# EAGLE design power supply (EAGLE 9.6.2)
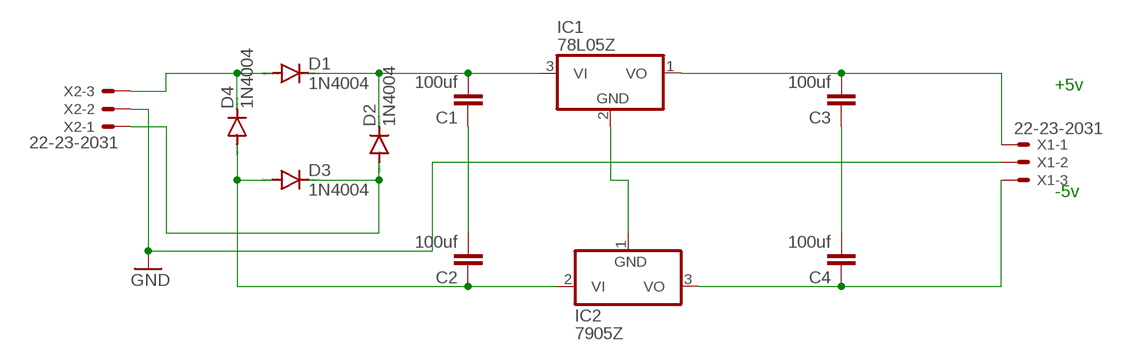
[diagram p0: schematic, sheet 1]

## Parts
C1  100uf  C2,5-3  [C2.5-3]
C2  100uf  C2,5-3  [C2.5-3]
C3  100uf  C2,5-3  [C2.5-3]
C4  100uf  C2,5-3  [C2.5-3]
D1  1N4004  [DO41-10]
D2  1N4004  [DO41-10]
D3  1N4004  [DO41-10]
D4  1N4004  [DO41-10]
IC1  78L05Z  [TO92]
IC2  7905Z  79L05Z  [TO92]
X1  22-23-2031  [22-23-2031]
X2  22-23-2031  [22-23-2031]

## Nets
GND: X1.2 X2.2
N$1: D1.A D4.C X2.3
N$2: C2.1 D3.A D4.A IC2.2(VI)
N$3: D2.A D3.C X2.1
N$4: C1.2 D1.C D2.C IC1.3(VI)
N$5: IC1.2(GND) IC2.1(GND)
N$6: C1.1 C2.2
N$7: C4.1 IC2.3(VO) X1.3
N$8: C3.2 IC1.1(VO) X1.1
N$9: C3.1 C4.2

## Notes on the sheet
- +5v
- -5v

## Library data of the parts
C1-C4 = capacitor-wima:C: CAPACITOR naming: grid - package width
D1-D4 = diode:1N4004: DIODE general purpose rectifier, 1 A
IC1 = linear:78*: Positive VOLTAGE REGULATOR Source: http://cache.national.com/ds/LM/LM78L05.pdf http://www.fairchildsemi.com/ds/LM/LM7805.pdf
IC2 = linear:79*: Negative VOLTAGE REGULATOR
X1 X2 = con-molex:22-23-2031: .100" (2.54mm) Center Header - 3 Pin; MF: MOLEX; MPN: 22-23-2031; OC_FARNELL: 1462950; OC_NEWARK: 30C0862

## Board
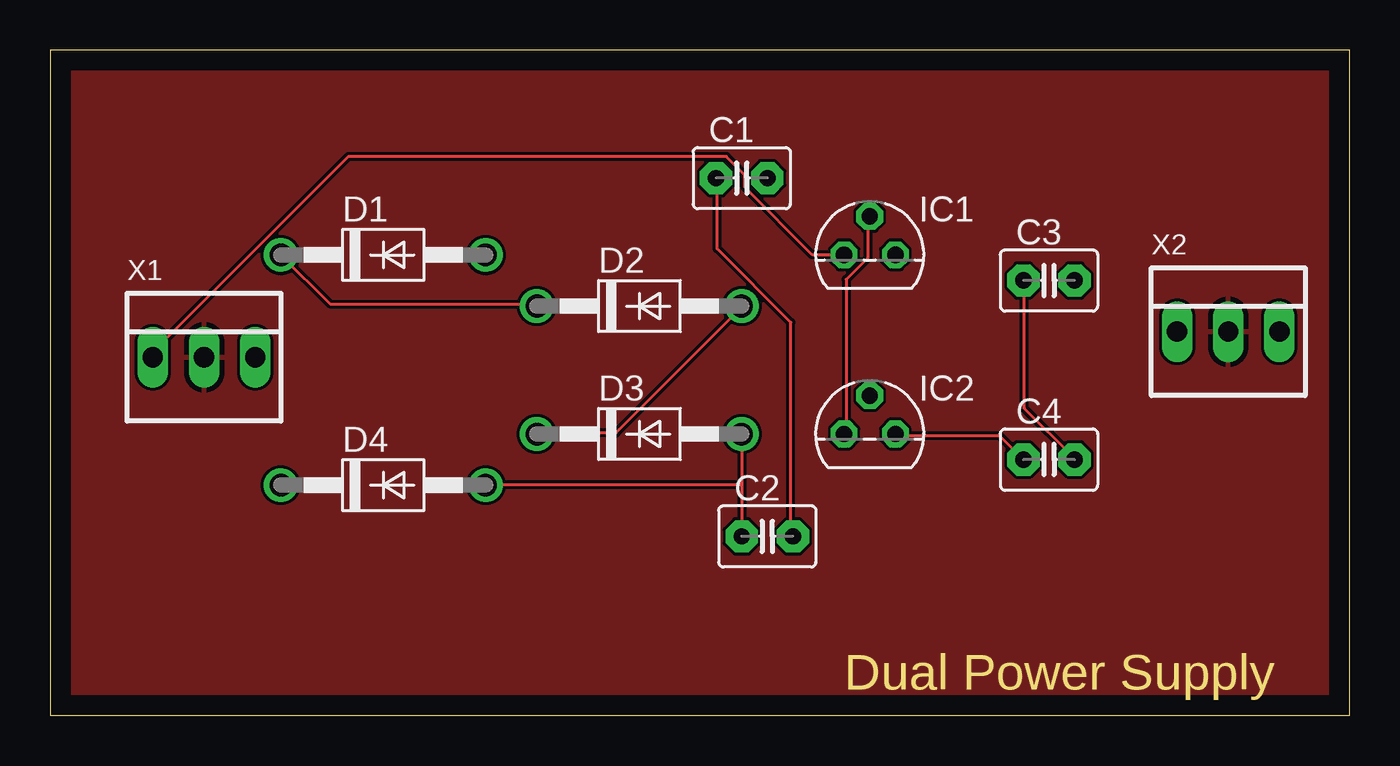
[diagram p1: board, top side]
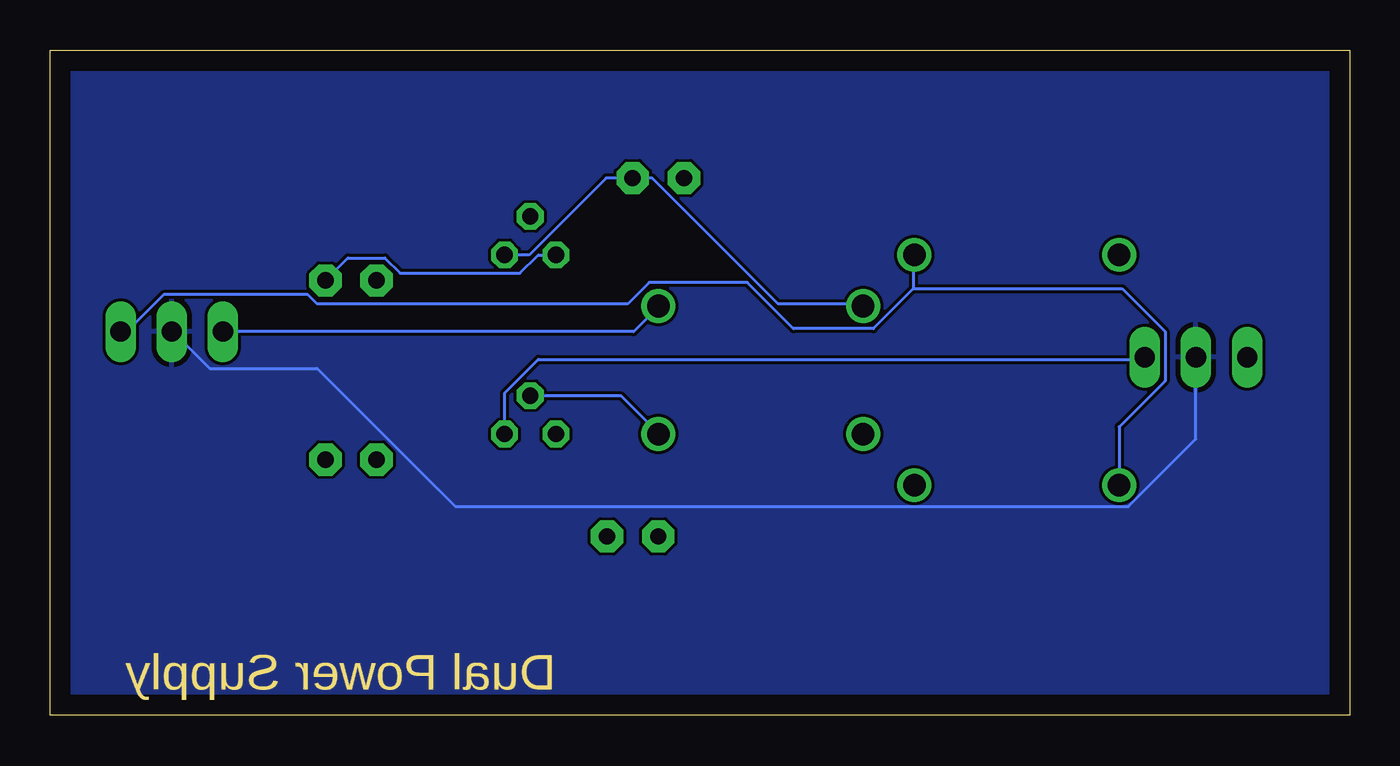
[diagram p2: board, bottom side, seen from below]

Size 64.44 x 33.01 mm. Coordinates in mm from the lower left corner, seen from the top.
Outline: 0,0 64.44,0 64.44,33.01 0,33.01 0,0
Copper layers (1*16): Top 0.035mm / dielectric 1.5mm / Bottom 0.035mm
Design rules "default": minimum track width 6mil, minimum drill 0.35mm, track to track 6mil, track to pad 6mil, pad to pad 6mil, via to via 6mil, smd to smd 6mil, copper to edge 40mil, drill to drill 6mil, minimum pad ring 10mil, minimum via ring 8mil, stop-mask expansion 4mil, vias tented up to drill 0mil, thermal gap 10mil

### Footprints (pad centres in the part's own frame; a part is rotated, then mirrored left to right if it is on the bottom)
C2.5-3 = drill 0.813 pad 1.6 octagon: 1 -1.27,0; 2 1.27,0
DO41-10 = drill 1.118: A 5.08,0; C -5.08,0
TO92 = drill 0.813 octagon: 1 -1.27,0; 2 0,1.905; 3 1.27,0
22-23-2031 = drill 1 long: 1 -2.54,0; 2 0,0; 3 2.54,0

### Placement (x,y rotation side)
C1  34.29,26.67 0 top
C2  35.56,8.89 0 top
C3  49.53,21.59 0 top
C4  49.53,12.7 0 top
D1  16.51,22.86 0 top
D2  29.21,20.32 0 top
D3  29.21,13.97 0 top
D4  16.51,11.43 0 top
IC1  40.64,22.86 0 top
IC2  40.64,13.97 0 top
X1  7.62,17.78 0 top
X2  58.42,19.05 0 top

### Tracks (layer width: path | path; a pad name or v marks a point on that pad's centre or on a via)
GND
  Bottom 0.152: X1.2 7.62,13.72 10.97,10.36 44.35,10.36 51.21,17.22 56.54,17.22 58.37,19.05 X2.2
  pour Bottom: -2.54,34.29 66.04,34.29 66.04,-1.27 -1.27,-1.27 -2.54,-1.27
  pour Top: -3.81,35.56 67.31,35.56 67.31,-2.54 -3.81,-2.54 -3.81,-1.27
N$1
  Bottom 0.152: X2.3 60.66,19.05 58.83,20.88 51.66,20.88 51.21,20.42 35.81,20.42 34.75,21.49 29.87,21.49 27.58,19.2 23.62,19.2 21.64,21.18 | 21.64,21.18 21.64,22.86 D1.A | D4.C 11.43,14.33 9.14,16.61 9.14,19.05 11.28,21.18 21.64,21.18
N$2
  Top 0.152: D3.A 34.29,11.43 | 34.29,11.43 C2.1 | 34.29,11.43 D4.A
  Bottom 0.152: IC2.2 40.54,15.85 36.12,15.85 34.29,14.02 D3.A
N$3
  Top 0.152: D3.C 24.23,14.02 28.04,14.02 34.29,20.27 D2.A
  Bottom 0.152: X2.1 35.51,19.05 34.29,20.27 D2.A
N$4
  Top 0.152: D1.C 13.87,20.42 24.08,20.42 D2.C
  Bottom 0.152: IC1.3 40.69,22.86 36.88,26.67 C1.2 34.59,26.67 28.35,20.42 24.23,20.42 D2.C
N$5
  Top 0.152: IC2.1 39.47,14.02 39.47,21.64 40.54,22.71 40.54,24.69 IC1.2
N$6
  Top 0.152: C1.1 33.07,26.67 33.07,23.17 36.73,19.51 36.73,8.99 C2.2
N$7
  Top 0.152: C4.1 47.09,13.87 41.91,13.87 IC2.3
  Bottom 0.152: IC2.3 41.91,16 40.23,17.68 10.21,17.68 X1.3
N$8
  Top 0.152: IC1.1 37.8,22.86 34.44,26.21 34.44,26.82 33.53,27.74 14.78,27.74 5.18,18.14 5.18,17.83 X1.1
  Bottom 0.152: IC1.1 40.23,22.86 41.15,21.95 47.09,21.95 47.85,22.71 49.68,22.71 C3.2
N$9
  Top 0.152: C3.1 48.31,21.49 48.31,15.24 50.75,12.8 C4.2

### Text on the board
Dimension: Dual Power Supply